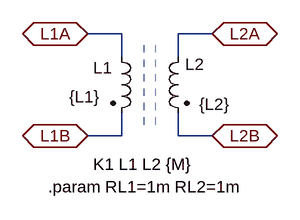
[diagram p0: schematic Trafo2L.asc]
Trafo2L.asc, the LTspice schematic file:
Version 4
SHEET 1 880 680
WIRE 272 112 224 112
WIRE 400 112 352 112
WIRE 272 144 272 112
WIRE 352 144 352 112
WIRE 272 256 272 224
WIRE 272 256 224 256
WIRE 352 256 352 224
WIRE 400 256 352 256
FLAG 224 112 L1A
IOPIN 224 112 BiDir
FLAG 224 256 L1B
IOPIN 224 256 BiDir
FLAG 400 112 L2A
IOPIN 400 112 BiDir
FLAG 400 256 L2B
IOPIN 400 256 BiDir
SYMBOL ind2 256 128 R0
WINDOW 0 -24 32 Left 2
WINDOW 3 -58 73 Left 2
SYMATTR InstName L1
SYMATTR Value {L1}
SYMATTR Type ind
SYMATTR SpiceLine Rser={RL1}
SYMBOL ind2 368 128 M0
WINDOW 0 -21 27 Left 2
WINDOW 3 -57 83 Left 2
SYMATTR InstName L2
SYMATTR Value {L2}
SYMATTR Type ind
SYMATTR SpiceLine Rser={RL2}
TEXT 232 296 Left 2 !K1 L1 L2 {M}
TEXT 168 328 Left 2 !.param RL1=1m RL2=1m
LINE Normal 304 240 304 128 2
LINE Normal 320 240 320 128 2

The netlist it stands for:
* Trafo2L.asc
L1 L1A L1B {L1} Rser={RL1}
L2 L2A L2B {L2} Rser={RL2}
K1 L1 L2 {M}
.param RL1=1m RL2=1m
.backanno
.end